# Altium schematic sheet SENSORS.SchDoc
size A4; Organization: ICNS, MARCS Institute; Address1: Werrington South Campus, Great Western Highway; Address2: Werrington, NSW, 2747; SheetNumber: 10; SheetTotal: 16
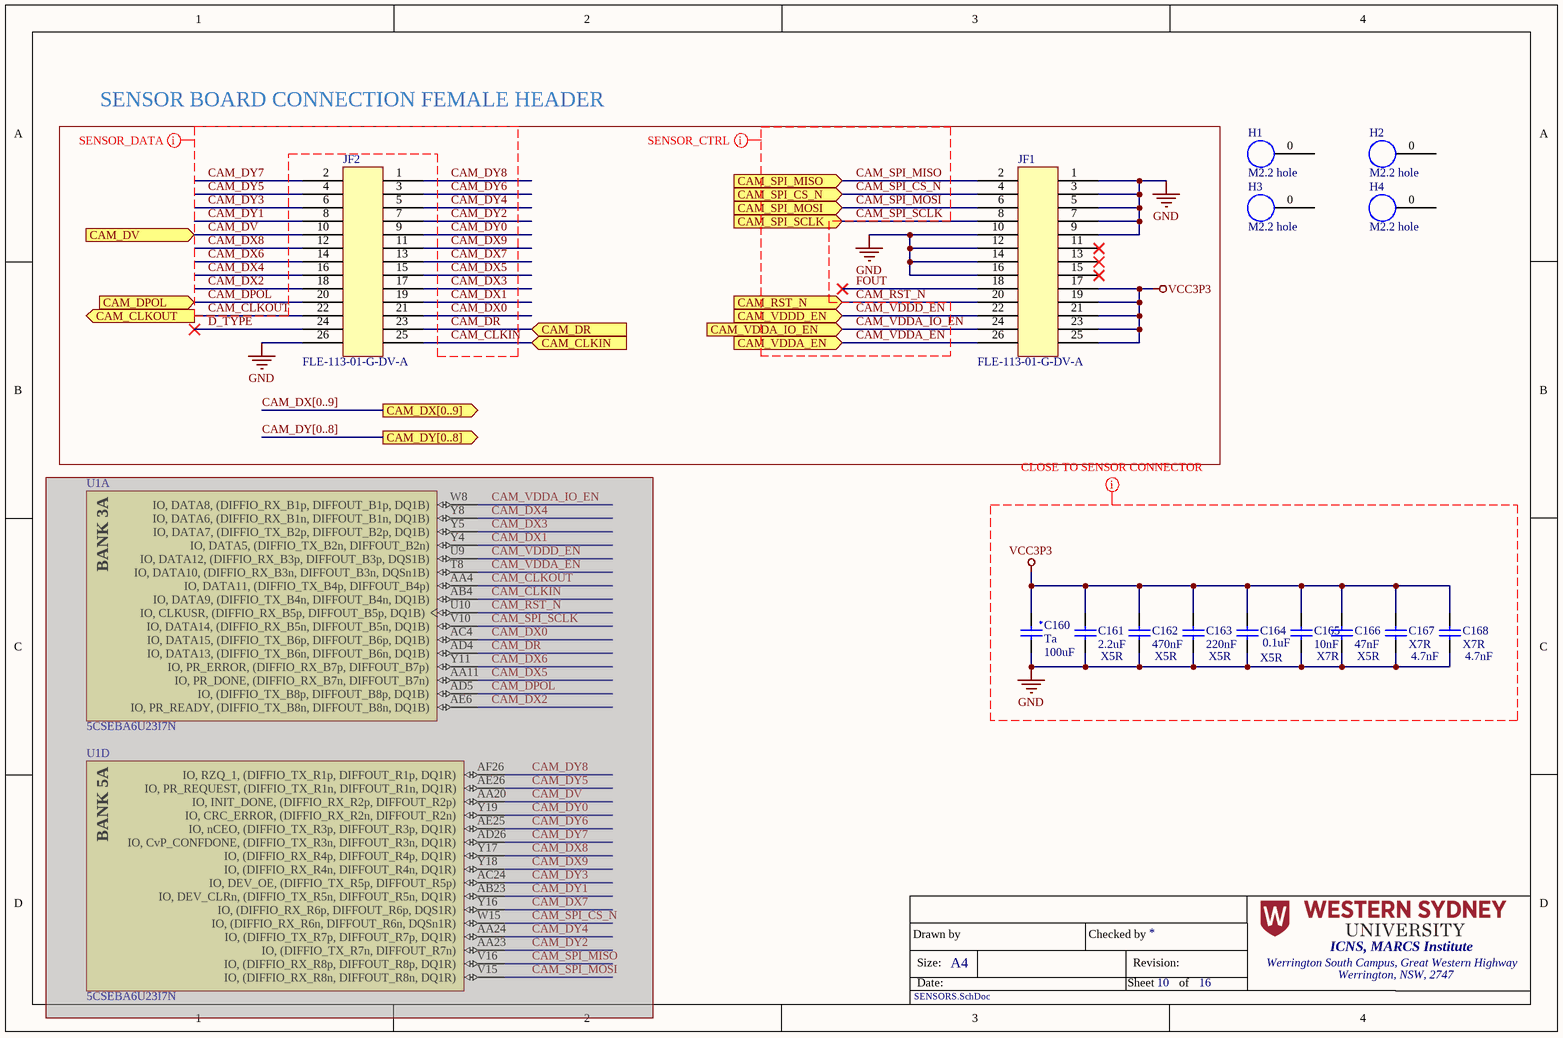
[diagram p0: SENSORS.SchDoc]

## Parts
C160  value 100uF  Dielectric: Ta  [CAPCP 0805 (2012)]  (hidden comment: TLCR107M006RTA)
C161  value 2.2uF  Dielectric: X5R  [CAP 0201 (0603)]  (hidden comment: GRM033R61A225KE47J)
C162  value 470nF  Dielectric: X5R  [CAP 0201 (0603)]  (hidden comment: LMK063BBJ474KPLF)
C163  value 220nF  Dielectric: X5R  [CAP 0201 (0603)]  (hidden comment: GRM033R61A224KE90D)
C164  value 0.1uF  Dielectric: X5R  [CAP 0201 (0603)]  (hidden comment: CL03A104KP3NNNC)
C165  value 10nF  Dielectric: X7R  [CAP 0201 (0603)]  (hidden comment: GRM033R71A103KA01D)
C166  value 47nF  Dielectric: X5R  [CAP 0201 (0603)]  (hidden comment: GRM033R60J473KE19D)
C167  Capacitance: 4.7nF  Dielectric: X7R  [CAP 0201 (0603)]  (hidden comment: CC0201KRX7R5BB472)
C168  Capacitance: 4.7nF  Dielectric: X7R  [CAP 0201 (0603)]  (hidden comment: CC0201KRX7R5BB472)
H1  M2.2 hole  [M2.2 hole]  (no BOM)
H2  M2.2 hole  [M2.2 hole]  (no BOM)
H3  M2.2 hole  [M2.2 hole]  (no BOM)
H4  M2.2 hole  [M2.2 hole]  (no BOM)
JF1  FLE-113-01-G-DV-A  [SAMTEC_FLE-113-01-G-DV-A]
JF2  FLE-113-01-G-DV-A  [SAMTEC_FLE-113-01-G-DV-A]
U1  5CSEBA6U23I7N  [ALTR-UBGA672_A-185]  (parts A,D of 21)  (masked out: inside a compile mask, not in the netlist)

## Blocks framed on the sheet
SENSOR BOARD CONNECTION FEMALE HEADER: JF1 JF2

## Ports
CAM_CLKIN (in), CAM_CLKOUT (out), CAM_DPOL (in), CAM_DR (in), CAM_DV (in), CAM_DX[0..9] (out), CAM_DY[0..8] (out), CAM_RST_N (in), CAM_SPI_CS_N (in), CAM_SPI_MISO (in), CAM_SPI_MOSI (in), CAM_SPI_SCLK (in), CAM_VDDA_EN (in), CAM_VDDA_IO_EN (in), CAM_VDDD_EN (in)

## Nets
GND: C160.2 C161.2 C162.2 C163.2 C164.2 C165.2 C166.2 C167.2 C168.2 JF1.1 JF1.3 JF1.5 JF1.7 JF1.9 JF1.10 JF1.12 JF1.14 JF1.16 JF2.26
VCC3P3: C160.1 C161.1 C162.1 C163.1 C164.1 C165.1 C166.1 C167.1 C168.1 JF1.17 JF1.19 JF1.21 JF1.23 JF1.25
CAM_CLKIN: JF2.25 ; port CAM_CLKIN
CAM_CLKOUT: JF2.22 ; port CAM_CLKOUT
CAM_DPOL: JF2.20 ; port CAM_DPOL
CAM_DR: JF2.23 ; port CAM_DR
CAM_DV: JF2.10 ; port CAM_DV
CAM_DX0: JF2.21
CAM_DX1: JF2.19
CAM_DX2: JF2.18
CAM_DX3: JF2.17
CAM_DX4: JF2.16
CAM_DX5: JF2.15
CAM_DX6: JF2.14
CAM_DX7: JF2.13
CAM_DX8: JF2.12
CAM_DX9: JF2.11
CAM_DY0: JF2.9
CAM_DY1: JF2.8
CAM_DY2: JF2.7
CAM_DY3: JF2.6
CAM_DY4: JF2.5
CAM_DY5: JF2.4
CAM_DY6: JF2.3
CAM_DY7: JF2.2
CAM_DY8: JF2.1
CAM_RST_N: JF1.20 ; port CAM_RST_N
CAM_SPI_CS_N: JF1.4 ; port CAM_SPI_CS_N
CAM_SPI_MISO: JF1.2 ; port CAM_SPI_MISO
CAM_SPI_MOSI: JF1.6 ; port CAM_SPI_MOSI
CAM_SPI_SCLK: JF1.8 ; port CAM_SPI_SCLK
CAM_VDDA_EN: JF1.26 ; port CAM_VDDA_EN
CAM_VDDA_IO_EN: JF1.24 ; port CAM_VDDA_IO_EN
CAM_VDDD_EN: JF1.22 ; port CAM_VDDD_EN
D_TYPE: JF2.24
FOUT: JF1.18

Not connected (* = marked no-connect by the designer): H1 0; H2 0; H3 0; H4 0; JF1 11* 13* 15*

## Buses and harness runs
bus CAM_DX[0..9] = port CAM_DX[0..9]
bus CAM_DY[0..8] = port CAM_DY[0..8]

## Layout directives
mark named CLOSE TO SENSOR CONNECTOR: GND, VCC3P3
net class DIGITAL; net class SENSOR_HS: CAM_CLKIN, CAM_CLKOUT, CAM_DPOL, CAM_DR, CAM_DV, CAM_DX0, CAM_DX1, CAM_DX2, CAM_DX3, CAM_DX4, CAM_DX5, CAM_DX6, CAM_DX7, CAM_DX8, CAM_DX9, CAM_DY0, CAM_DY1, CAM_DY2, CAM_DY3, CAM_DY4, CAM_DY5, CAM_DY6, CAM_DY7, CAM_DY8
net class DIGITAL; net class SENSOR_CTRL: CAM_RST_N, CAM_SPI_CS_N, CAM_SPI_MISO, CAM_SPI_MOSI, CAM_SPI_SCLK, CAM_VDDA_EN, CAM_VDDA_IO_EN, CAM_VDDD_EN

## Notes on the sheet
- Drawn by
- Size:
- Date:
- A4
- Checked by
- Sheet
- Revision:
- of
- (in symbol CMP-005-000007-1, part A) BANK 3A
- (in symbol CMP-005-000007-1, part D) BANK 5A

## Library data of the parts
C160 = CMP-003-000001-2: Cap Tant Solid 100uF 6.3V R CASE 20% (2 X 1.35 X 1.35mm) SMD 2012-15 5 Ohm 125°C Plastic T/R; Manufacturer 1: Kyocera AVX; ESR (Equivalent Series Resistance): 5R; Leakage Current: 6uA; Construction: Flat; Length: 2mm; Case/Package: 0805; Voltage Rating (DC): 6.3V; Series: TLC; Max Operating Temperature: 125°C; Tolerance: 20%; Min Operating Temperature: -55°C; Mount: Surface Mount; Width: 0.053inch; Depth: 1.35mm; Case Code (Imperial): 0805; Termination: SMD/SMT; Features: General Purpose; Voltage Rating: 6.3V; Case Code (Metric): 2012; Radiation Hardening: No; Capacitance: 100uF; Package Quantity: 1; RoHS Compliant: Yes; Height: 1.5mm; Packaging: Tape and Reel; Height - Seated (Max): 0.059inch; ComponentLink5URL: https://datasheet.ciiva.com/264/tlc-264932.pdf?src-supplier=Digi-Key; ComponentLink5Description: https://datasheet.ciiva.com/264/tlc-264932.pdf?src-supplier=Digi-Key; ComponentLink1Description: https://datasheet.ciiva.com/16299/tantniob-16299237.pdf?src-supplier=Future+Electronics; ComponentLink3Description: https://datasheet.ciiva.com/264/tlc-264930.pdf?src-supplier=Digi-Key; Stock 1: 3919; ComponentLink4URL: https://datasheet.ciiva.com/264/tlc-264931.pdf?src-supplier=Digi-Key; Pricing 1: 1=2.74000, 10=2.21400, 50=1.93200, 100=1.69050, 500=1.28800, 1000=1.12700 (USD); ComponentLink2Description: https://datasheet.ciiva.com/17337/tlc-17337857.pdf?src-supplier=Avnet+Europe; ComponentLink3URL: https://datasheet.ciiva.com/264/tlc-264930.pdf?src-supplier=Digi-Key; RoHS: Yes; ComponentLink4Description: https://datasheet.ciiva.com/264/tlc-264931.pdf?src-supplier=Digi-Key; Manufacturer Part Number 1: TLCR107M006RTA; Source: ICNS_PropheseeLib.SchLib; ComponentLink6Description: https://datasheet.ciiva.com/12882/tlc-4380-12882614.pdf?src-supplier=Mouser; Description 1: Cap Tant Solid 100uF 6.3V R CASE 20% (2 X 1.35 X 1.35mm) SMD 2012-15 5 Ohm 125°C Plastic T/R; Lead Free: Lead Free; ComponentLink1URL: https://datasheet.ciiva.com/16299/tantniob-16299237.pdf?src-supplier=Future+Electronics; Category: Tantalum Capacitors; ComponentLink2URL: https://datasheet.ciiva.com/17337/tlc-17337857.pdf?src-supplier=Avnet+Europe; ComponentLink6URL: https://datasheet.ciiva.com/12882/tlc-4380-12882614.pdf?src-supplier=Mouser; Design Item ID: TLCR107M006RTA
C161 = CMP-003-000021-1: Cap Ceramic 2.2uF 10VDC X5R 10% SMD 0201 Paper T/R  Monolithic; Manufacturer: Murata; Voltage Rating: 10V; Capacitance: 2.2uF; ComponentLink1URL: https://search.murata.co.jp/Ceramy/image/img/A01X/G101/ENG/GRM033R61A225KE47-04A.pdf?src-supplier=Digi-Key; Case Code Imperial: 0201; Source: ICNS_PropheseeLib.SchLib; Pricing 1: 1=0.29000, 10=0.20000, 50=0.11980, 100=0.10120, 500=0.06922, 1000=0.06123, 2500=0.05856, 5000=0.05324 (USD); RoHS: Yes; Manufacturer Part Number: GRM033R61A225KE47J; Design Item ID: GRM033R61A225KE47J; Category: Ceramic Capacitors; ComponentLink1Description: https://search.murata.co.jp/Ceramy/image/img/A01X/G101/ENG/GRM033R61A225KE47-04A.pdf?src-supplier=Digi-Key; Stock 1: 25152; RoHS Compliant: Yes
C162 = CMP-003-000027-1: Cap Multilayer Ceramic 0.47 uF 10V X5R  0201 10% RoHS  (High dielectric type); Manufacturer: Taiyo Yuden; Case Code (Imperial): 0201; Voltage Rating (DC): 10V; RoHS Compliant: Yes; Capacitance: 470nF; Pricing 1: 1=0.22500, 25=0.09300, 100=0.07600, 250=0.06500, 500=0.05400, 1000=0.04400 (USD); Manufacturer Part Number: LMK063BBJ474KPLF; RoHS: Yes; Source: ICNS_PropheseeLib.SchLib; ComponentLink1Description: http://www.farnell.com/datasheets/2820091.pdf?src-supplier=Farnell; Design Item ID: LMK063BBJ474KPLF; Category: Ceramic Capacitors; ComponentLink1URL: http://www.farnell.com/datasheets/2820091.pdf?src-supplier=Farnell; Stock 1: 12200
C163 = CMP-003-000020-1: Cap Multilayer Ceramic 220nF 10V X5R 0201 ±10% Tolerance; Manufacturer: Murata; Voltage Rating (DC): 10V; Packaging: Tape and Reel; Width: 0.012inch; Case/Package: 0201; Thickness: 0.013inch; Case Code (Imperial): 0201; Voltage Rating: 10V; Case Code (Metric): 0603; Max Operating Temperature: 85°C; Tolerance: 10%; Capacitance: 220nF; Min Operating Temperature: -55°C; Length: 0.024inch; RoHS Compliant: Yes; Mount: Surface Mount; ComponentLink2Description: http://www.mouser.com/ds/2/281/c02e-2905.pdf?src-supplier=Mouser; ComponentLink3URL: http://search.murata.co.jp/Ceramy/image/img/A01X/G101/ENG/GRM033R61A224KE90-01.pdf?src-supplier=Digi-Key; RoHS: Yes; Manufacturer Part Number: GRM033R61A224KE90D; ComponentLink2URL: http://www.mouser.com/ds/2/281/c02e-2905.pdf?src-supplier=Mouser; Stock 1: 391; Category: Ceramic Capacitors; ComponentLink4Description: http://www.farnell.com/datasheets/2867835.pdf?src-supplier=Newark; ComponentLink1Description: http://www.farnell.com/datasheets/2867835.pdf?src-supplier=Farnell; ComponentLink3Description: http://search.murata.co.jp/Ceramy/image/img/A01X/G101/ENG/GRM033R61A224KE90-01.pdf?src-supplier=Digi-Key; ComponentLink1URL: http://www.farnell.com/datasheets/2867835.pdf?src-supplier=Farnell; Design Item ID: GRM033R61A224KE90D; Pricing 1: 1=0.10000, 10=0.03600, 50=0.01980, 100=0.01620, 500=0.01156, 1000=0.00908, 2500=0.00825, 5000=0.00759 (USD); ComponentLink4URL: http://www.farnell.com/datasheets/2867835.pdf?src-supplier=Newark; Source: ICNS_PropheseeLib.SchLib
C164 = CMP-003-000014-1: Cap Ceramic 0.1uF 10V X5R 10% Pad SMD 0201 85C T/R; Manufacturer: Samsung; Capacitance: 100nF; Tolerance: 10%; ComponentLink2URL: https://datasheet.ciiva.com/26838/getdatasheetpartid-357484-26838083.pdf?src-supplier=Verical; Category: Ceramic Capacitors; Voltage Rating: 10V; Lead Free: Lead Free; Height: 0.3mm; ComponentLink2Description: https://datasheet.ciiva.com/26838/getdatasheetpartid-357484-26838083.pdf?src-supplier=Verical; RoHS: Yes; Manufacturer Part Number: CL03A104KP3NNNC; Case Code (Imperial): 0201; Source: ICNS_PropheseeLib.SchLib; Depth: 0.3mm; Mount: Surface Mount; Stock 1: 12175; Package Quantity: 1; Packaging: Tape and Reel; ComponentLink1Description: https://datasheet.ciiva.com/25803/cl03a104kp3nnnc-25803204.pdf?src-supplier=Digi-Key; Case Code (Metric): 0603; Width: 0.012inch; Length: 0.6mm; Radiation Hardening: No; Series: CL; Thickness: 0.013inch; Max Operating Temperature: 85°C; Design Item ID: CL03A104KP3NNNC; Voltage Rating (DC): 10V; Case/Package: 0201; Contact Plating: Tin; Min Operating Temperature: -55°C; Construction: Flat; Pricing 1: 1=0.10000, 10=0.02900, 50=0.01600, 100=0.01300, 500=0.00932, 1000=0.00732, 2500=0.00666, 5000=0.00612 (USD); ComponentLink1URL: https://datasheet.ciiva.com/25803/cl03a104kp3nnnc-25803204.pdf?src-supplier=Digi-Key
C165 = CMP-003-000022-2: Cap Multilayer Ceramic 10nF 10V X7R 0201 ±10 % Tolerance SMT; Manufacturer: Murata; Tolerance: 10%; Package Quantity: 1; Width: 0.012inch; Voltage: 10V; Mount: Surface Mount; Capacitance: 10nF; Voltage Rating (DC): 10V; Voltage Rating: 10V; Length: 0.6mm; Packaging: Tape and Reel; Material: Ceramic; REACH SVHC: No SVHC; Termination: SMD/SMT; Case/Package: 0201; Radiation Hardening: No; Height: 0.3mm; Case Code (Imperial): 0201; Min Operating Temperature: -55°C; Lead Free: Lead Free; Thickness: 0.013inch; Depth: 0.3mm; Case Code (Metric): 0603; Max Operating Temperature: 125°C; Design Item ID: GRM033R71A103KA01D; ComponentLink3URL: https://datasheet.ciiva.com/11789/0900766b80ef921d-11789049.pdf?src-supplier=RSComponents; Stock 1: 6245; ComponentLink2URL: https://datasheet.ciiva.com/129/grm033r71a103ka01-01-129815.pdf?src-supplier=Digi-Key; Source: ICNS_PropheseeLib.SchLib; ComponentLink1URL: https://datasheet.ciiva.com/129/grm033r71a103ka01-01-129814.pdf?src-supplier=Digi-Key; ComponentLink4URL: https://datasheet.ciiva.com/16467/product-16467346.pdf?src-supplier=Future+Electronics; RoHS: Yes; RoHS Compliant: Yes; ComponentLink3Description: https://datasheet.ciiva.com/11789/0900766b80ef921d-11789049.pdf?src-supplier=RSComponents; ComponentLink5URL: https://datasheet.ciiva.com/18184/getdatasheetpartid-158821-18184066.pdf?src-supplier=Verical; ComponentLink7Description: https://datasheet.ciiva.com/5422/product-5422667.pdf?src-supplier=Mouser; Pricing 1: 1=0.10000, 10=0.02000, 50=0.01060, 100=0.00870, 500=0.00624, 1000=0.00490, 2500=0.00446, 5000=0.00410 (USD); Manufacturer Part Number: GRM033R71A103KA01D; ComponentLink1Description: https://datasheet.ciiva.com/129/grm033r71a103ka01-01-129814.pdf?src-supplier=Digi-Key; ComponentLink5Description: https://datasheet.ciiva.com/18184/getdatasheetpartid-158821-18184066.pdf?src-supplier=Verical; ComponentLink7URL: https://datasheet.ciiva.com/5422/product-5422667.pdf?src-supplier=Mouser; ComponentLink2Description: https://datasheet.ciiva.com/129/grm033r71a103ka01-01-129815.pdf?src-supplier=Digi-Key; Category: Ceramic Capacitors; ComponentLink6URL: https://datasheet.ciiva.com/29199/455719-da-01-en-vs-kondensator-0201-29199284.pdf?src-supplier=Conrad; ComponentLink4Description: https://datasheet.ciiva.com/16467/product-16467346.pdf?src-supplier=Future+Electronics; ComponentLink6Description: https://datasheet.ciiva.com/29199/455719-da-01-en-vs-kondensator-0201-29199284.pdf?src-supplier=Conrad
C166 = CMP-003-000019-1: Cap Multilayer Ceramic 47nF 6.3V X5R SMT 0201±10% Tolerance; Manufacturer: Murata; Tolerance: 10%; Capacitance: 47nF; Thickness: 0.013inch; Lead Free: Lead Free; Case Code (Metric): 0603; Length: 0.6mm; Max Operating Temperature: 85°C; Min Operating Temperature: -55°C; Termination: SMD/SMT; Packaging: Tape and Reel; Case/Package: 0201; Mount: Surface Mount; Width: 0.012inch; Case Code (Imperial): 0201; Height: 0.3mm; Package Quantity: 15000; Voltage Rating: 6.3V; Voltage Rating (DC): 6.3V; ComponentLink3URL: https://datasheet.ciiva.com/29199/455678-da-01-en-vs-kondensator-0201-29199271.pdf?src-supplier=Conrad; Stock 1: 134562; ComponentLink1Description: https://datasheet.ciiva.com/6270/product-6270930.pdf?src-supplier=Digi-Key; RoHS Compliant: Yes; ComponentLink2Description: https://datasheet.ciiva.com/18184/getdatasheetpartid-223883-18184048.pdf?src-supplier=Verical; REACH SVHC: No SVHC; Depth: 0.3mm; ComponentLink3Description: https://datasheet.ciiva.com/29199/455678-da-01-en-vs-kondensator-0201-29199271.pdf?src-supplier=Conrad; Category: Ceramic Capacitors; ComponentLink2URL: https://datasheet.ciiva.com/18184/getdatasheetpartid-223883-18184048.pdf?src-supplier=Verical; Series: GRM; ComponentLink1URL: https://datasheet.ciiva.com/6270/product-6270930.pdf?src-supplier=Digi-Key; RoHS: Yes; Source: ICNS_PropheseeLib.SchLib; Material: Ceramic; Manufacturer Part Number: GRM033R60J473KE19D; Construction: Flat; Pricing 1: 1=0.10000, 10=0.05900, 50=0.03240, 100=0.02640, 500=0.01886, 1000=0.01482, 2500=0.01348, 5000=0.01240 (USD); Radiation Hardening: No; Design Item ID: GRM033R60J473KE19D
C167 C168 = CMP-003-000018-1: Cap Ceramic 4.7nF 6.3V X7R 10% Pad SMD 0201 125C Automotive T/R; Manufacturer: Yageo; ComponentLink2Description: https://datasheet.ciiva.com/176/mlccorderingcode-176533.pdf?src-supplier=Digi-Key; Category: Ceramic Capacitors; Tolerance: 10%; ComponentLink2URL: https://datasheet.ciiva.com/176/mlccorderingcode-176533.pdf?src-supplier=Digi-Key; Value: 4.7nF; Manufacturer Part Number: CC0201KRX7R5BB472; Voltage Rating: 6.3V; RoHS: Yes; Lead Free: Lead Free; ComponentLink1Description: https://datasheet.ciiva.com/176/mlccorderingcode-176532.pdf?src-supplier=Digi-Key; Case Code (Metric): 0603; Width: 0.012inch; Thickness: 0.013inch; Pricing 1: 1=0.10000, 10=0.02400, 50=0.01320, 100=0.01080, 500=0.00770, 1000=0.00605, 2500=0.00550, 5000=0.00506 (USD); Source: ICNS_PropheseeLib.SchLib; Max Operating Temperature: 125°C; Termination: SMD/SMT; ComponentLink3URL: https://datasheet.ciiva.com/176/mlccorderingcode-176531.pdf?src-supplier=Digi-Key; Case/Package: 0201; Voltage Rating (DC): 6.3V; Series: CC; Resistor Type: Ceramic; Case Code (Imperial): 0201; Packaging: Tape and Reel; RoHS Compliant: Yes; Design Item ID: CC0201KRX7R5BB472; ComponentLink1URL: https://datasheet.ciiva.com/176/mlccorderingcode-176532.pdf?src-supplier=Digi-Key; Mount: Surface Mount; Min Operating Temperature: -55°C; Stock 1: 3450; Length: 0.024inch; Halogen Free: Halogen Free; Weight: 6E-06oz; Package Quantity: 1; ComponentLink3Description: https://datasheet.ciiva.com/176/mlccorderingcode-176531.pdf?src-supplier=Digi-Key
H1-H4 = CMP-019-000000-1: M2.2 through hole not plated; Source: ICNS_PropheseeLib.SchLib; Design Item ID: M2.2 hole
JF1 JF2 = CMP-010-000015-1: 26 Position Receptacle Connector 0.050" (1.27mm) Surface Mount Gold 2 Row Alignment Pin; Manufacturer: Samtec; Contact Resistance: 15mR; Number of Contacts: 26; Gender: Female; Housing Material: Polymer; Contact Material: Bronze; ComponentLink3URL: http://suddendocs.samtec.com/prints/fle-1xx-xx-xx-dv-x-footprint.pdf?src-supplier=Digi-Key; Packaging: Rail/Tube; Manufacturer Part Number: FLE-113-01-G-DV-A; Number of Rows: 2; ComponentLink3Description: http://suddendocs.samtec.com/prints/fle-1xx-xx-xx-dv-x-footprint.pdf?src-supplier=Digi-Key; RoHS: Yes; Housing Color: Black; Orientation: Straight; ComponentLink1Description: http://components.arrow.com/part/dataview/2747712S6498977N1004?src-supplier=Arrow+Electronics; Design Item ID: FLE-113-01-G-DV-A; ComponentLink2Description: http://cloud.samtec.com/catalog_english/FLE_SM.PDF?src-supplier=Avnet; Min Operating Temperature: -55°C; ComponentLink1URL: http://components.arrow.com/part/dataview/2747712S6498977N1004?src-supplier=Arrow+Electronics; Stock 1: 1; Termination: Solder; Length: 16.62mm; Source: ICNS_PropheseeLib.SchLib; Max Operating Temperature: 125°C; Contact Plating: Gold; ComponentLink2URL: http://cloud.samtec.com/catalog_english/FLE_SM.PDF?src-supplier=Avnet; Pitch: 1.27mm; Category: Connectors; Depth: 4.6mm; Radiation Hardening: No; RoHS Compliant: Yes; Pricing 1: 35=3.37300 (USD)
U1 = CMP-005-000007-1: Cyclone V SE Family FPGA, 1.07 to 1.13 V Supply, 145 I/O Pins, 6 PLLs, 672-Pin UBGA, Speed Grade 7, Industrial Grade, RoHS Compliant; Manufacturer: Altera; Speed Grade: 7; Logic Elements (LE) (K): 110; NexusDeviceID: 5CSEBA6U23I7N; Voltage Supply: 1.07 to 1.13 V; ComponentLink5Description: Device Pin-Out URL; ComponentLink3URL: http://www.altera.com/devicepackaging/04R00437-01.pdf; Code_JEDEC: MO-216; ComponentLink1URL: http://www.altera.com; DatasheetVersion: Rev. 3.4; ComponentLink6Description: Product URL; PackageReference: UBGA672_A-185; PackageDescription: 672-Pin Ultra FineLine Ball-Grid Array (UBGA), Body 23 x 23 mm, Pitch 0.8 mm; PackageVersion: Rev. 2.0, 12/2012; ComponentLink5URL: http://www.altera.com/literature/dp/cyclone-v/5CSEBA6.xls; ComponentLink4URL: http://www.altera.com/literature/hb/cyclone-v/cyclone5_handbook.pdf; ComponentLink4Description: Device Handbook URL; PartNumber: 5CSEBA6U23I7N; ComponentLink2URL: http://www.altera.com/literature/hb/cyclone-v/cv_51002.pdf; ComponentLink1Description: Manufacturer URL; RoHS: RoHS Compliant; Device Group: 5CSEBA6; ComponentLink3Description: Package Specification; ComponentLink2Description: Datasheet; Subcategory: Cyclone V SE; ComponentLink6URL: http://www.buyaltera.com/scripts/partsearch.dll?Detail&name=5CSEBA6U23I7N-ND; Mounting Technology: Surface Mount; Design Item ID: 5CSEBA6U23I7N; Source: ICNS_PropheseeLib.SchLib